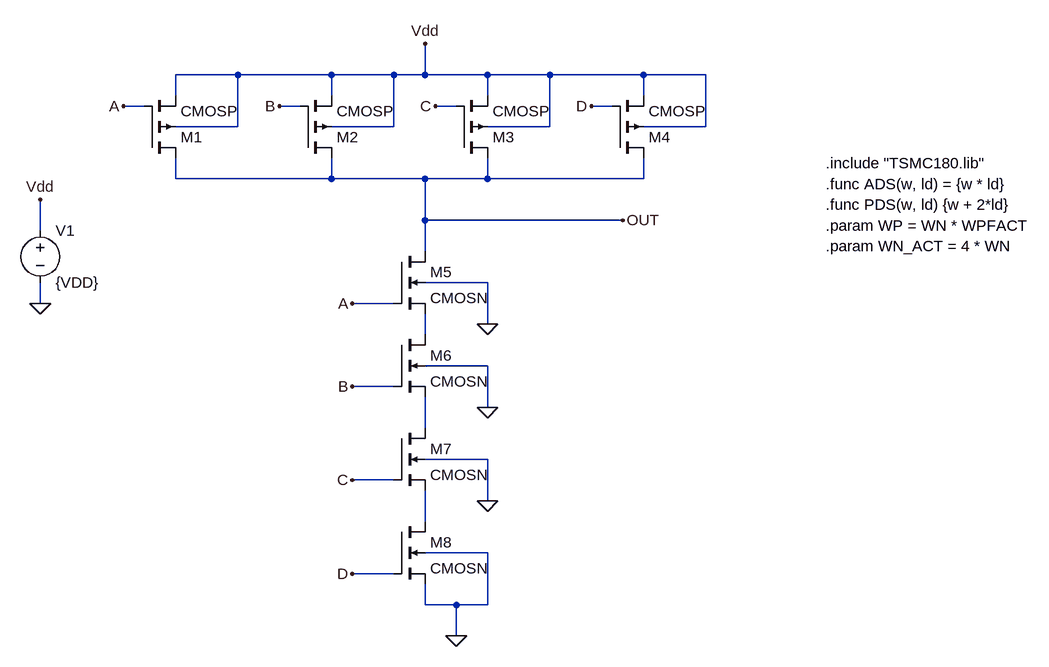
[diagram p0: schematic nand4.asc]
nand4.asc, the LTspice schematic file:
Version 4
SHEET 1 1180 868
WIRE -112 -16 -208 -16
WIRE 32 -16 -112 -16
WIRE 128 -16 32 -16
WIRE 176 -16 176 -64
WIRE 176 -16 128 -16
WIRE 272 -16 176 -16
WIRE 368 -16 272 -16
WIRE 512 -16 368 -16
WIRE 608 -16 512 -16
WIRE -208 16 -208 -16
WIRE 32 16 32 -16
WIRE 272 16 272 -16
WIRE 512 16 512 -16
WIRE -256 32 -288 32
WIRE -16 32 -48 32
WIRE 224 32 192 32
WIRE 464 32 432 32
WIRE -112 64 -112 -16
WIRE -112 64 -208 64
WIRE 128 64 128 -16
WIRE 128 64 32 64
WIRE 368 64 368 -16
WIRE 368 64 272 64
WIRE 608 64 608 -16
WIRE 608 64 512 64
WIRE -208 144 -208 112
WIRE 32 144 32 112
WIRE 32 144 -208 144
WIRE 176 144 32 144
WIRE 272 144 272 112
WIRE 272 144 176 144
WIRE 512 144 512 112
WIRE 512 144 272 144
WIRE 176 208 176 144
WIRE 480 208 176 208
WIRE -416 224 -416 176
WIRE 176 256 176 208
WIRE 272 304 176 304
WIRE -416 336 -416 304
WIRE 128 336 64 336
WIRE 272 368 272 304
WIRE 176 384 176 352
WIRE 272 432 176 432
WIRE 128 464 64 464
WIRE 272 496 272 432
WIRE 176 528 176 480
WIRE 272 576 176 576
WIRE 128 608 64 608
WIRE 272 640 272 576
WIRE 176 672 176 624
WIRE 272 720 176 720
WIRE 128 752 64 752
WIRE 176 800 176 768
WIRE 224 800 176 800
WIRE 272 800 272 720
WIRE 272 800 224 800
WIRE 224 848 224 800
FLAG -416 176 Vdd
FLAG -416 336 0
FLAG 176 -64 Vdd
FLAG -288 32 A
FLAG 64 336 A
FLAG -48 32 B
FLAG 64 464 B
FLAG 480 208 OUT
FLAG 272 368 0
FLAG 192 32 C
FLAG 272 496 0
FLAG 64 752 D
FLAG 224 848 0
FLAG 432 32 D
FLAG 64 608 C
FLAG 272 640 0
SYMBOL nmos4 128 256 R0
SYMATTR InstName M5
SYMATTR Value CMOSN
SYMATTR Value2 l={L} w={WN_ACT} ad={ADS(WN_ACT,LD)} as={ADS(WN_ACT,LD)} pd={PDS(WN_ACT,LD)} ps={PDS(WN_ACT,LD)}
SYMBOL pmos4 -16 112 M180
SYMATTR InstName M2
SYMATTR Value CMOSP
SYMATTR Value2 l={L} w={WP} ad={ADS(WP,LD)} as={ADS(WP,LD)} pd={PDS(WP,LD)} ps={PDS(WP,LD)}
SYMBOL voltage -416 208 R0
WINDOW 123 0 0 Left 0
WINDOW 39 0 0 Left 0
SYMATTR InstName V1
SYMATTR Value {VDD}
SYMBOL pmos4 -256 112 M180
SYMATTR InstName M1
SYMATTR Value CMOSP
SYMATTR Value2 l={L} w={WP} ad={ADS(WP,LD)} as={ADS(WP,LD)} pd={PDS(WP,LD)} ps={PDS(WP,LD)}
SYMBOL pmos4 224 112 M180
SYMATTR InstName M3
SYMATTR Value CMOSP
SYMATTR Value2 l={L} w={WP} ad={ADS(WP,LD)} as={ADS(WP,LD)} pd={PDS(WP,LD)} ps={PDS(WP,LD)}
SYMBOL pmos4 464 112 M180
SYMATTR InstName M4
SYMATTR Value CMOSP
SYMATTR Value2 l={L} w={WP} ad={ADS(WP,LD)} as={ADS(WP,LD)} pd={PDS(WP,LD)} ps={PDS(WP,LD)}
SYMBOL nmos4 128 384 R0
SYMATTR InstName M6
SYMATTR Value CMOSN
SYMATTR Value2 l={L} w={WN_ACT} ad={ADS(WN_ACT,LD)} as={ADS(WN_ACT,LD)} pd={PDS(WN_ACT,LD)} ps={PDS(WN_ACT,LD)}
SYMBOL nmos4 128 528 R0
SYMATTR InstName M7
SYMATTR Value CMOSN
SYMATTR Value2 l={L} w={WN_ACT} ad={ADS(WN_ACT,LD)} as={ADS(WN_ACT,LD)} pd={PDS(WN_ACT,LD)} ps={PDS(WN_ACT,LD)}
SYMBOL nmos4 128 672 R0
SYMATTR InstName M8
SYMATTR Value CMOSN
SYMATTR Value2 l={L} w={WN_ACT} ad={ADS(WN_ACT,LD)} as={ADS(WN_ACT,LD)} pd={PDS(WN_ACT,LD)} ps={PDS(WN_ACT,LD)}
TEXT 792 216 Left 2 !.param WP = WN * WPFACT
TEXT 792 120 Left 2 !.include "TSMC180.lib"
TEXT 792 152 Left 2 !.func ADS(w, ld) = {w * ld}
TEXT 792 184 Left 2 !.func PDS(w, ld) {w + 2*ld}
TEXT 792 248 Left 2 !.param WN_ACT = 4 * WN

The netlist it stands for:
* nand4.asc
M5 OUT A N001 0 CMOSN l={L} w={WN_ACT} ad={ADS(WN_ACT,LD)} as={ADS(WN_ACT,LD)} pd={PDS(WN_ACT,LD)} ps={PDS(WN_ACT,LD)}
M2 OUT B Vdd Vdd CMOSP l={L} w={WP} ad={ADS(WP,LD)} as={ADS(WP,LD)} pd={PDS(WP,LD)} ps={PDS(WP,LD)}
V1 Vdd 0 {VDD}
M1 OUT A Vdd Vdd CMOSP l={L} w={WP} ad={ADS(WP,LD)} as={ADS(WP,LD)} pd={PDS(WP,LD)} ps={PDS(WP,LD)}
M3 OUT C Vdd Vdd CMOSP l={L} w={WP} ad={ADS(WP,LD)} as={ADS(WP,LD)} pd={PDS(WP,LD)} ps={PDS(WP,LD)}
M4 OUT D Vdd Vdd CMOSP l={L} w={WP} ad={ADS(WP,LD)} as={ADS(WP,LD)} pd={PDS(WP,LD)} ps={PDS(WP,LD)}
M6 N001 B N002 0 CMOSN l={L} w={WN_ACT} ad={ADS(WN_ACT,LD)} as={ADS(WN_ACT,LD)} pd={PDS(WN_ACT,LD)} ps={PDS(WN_ACT,LD)}
M7 N002 C N003 0 CMOSN l={L} w={WN_ACT} ad={ADS(WN_ACT,LD)} as={ADS(WN_ACT,LD)} pd={PDS(WN_ACT,LD)} ps={PDS(WN_ACT,LD)}
M8 N003 D 0 0 CMOSN l={L} w={WN_ACT} ad={ADS(WN_ACT,LD)} as={ADS(WN_ACT,LD)} pd={PDS(WN_ACT,LD)} ps={PDS(WN_ACT,LD)}
.model NMOS NMOS
.model PMOS PMOS
.lib standard.mos
.param WP = WN * WPFACT
.include "TSMC180.lib"
.func ADS(w, ld) = {w * ld}
.func PDS(w, ld) {w + 2*ld}
.param WN_ACT = 4 * WN
.backanno
.end